# Altium schematic sheet pca20020_sheet1_cover.SchDoc: PCA20020 - Cover
size A4; DocumentNumber: 1; Revision: 1.0.0; SheetNumber: 1; SheetTotal: 9; DrawnBy: RUBR; DocumentSize: A4; PCBRevision: 0264RUBR; PCAName: PCA20020; PCBNumber: 400182
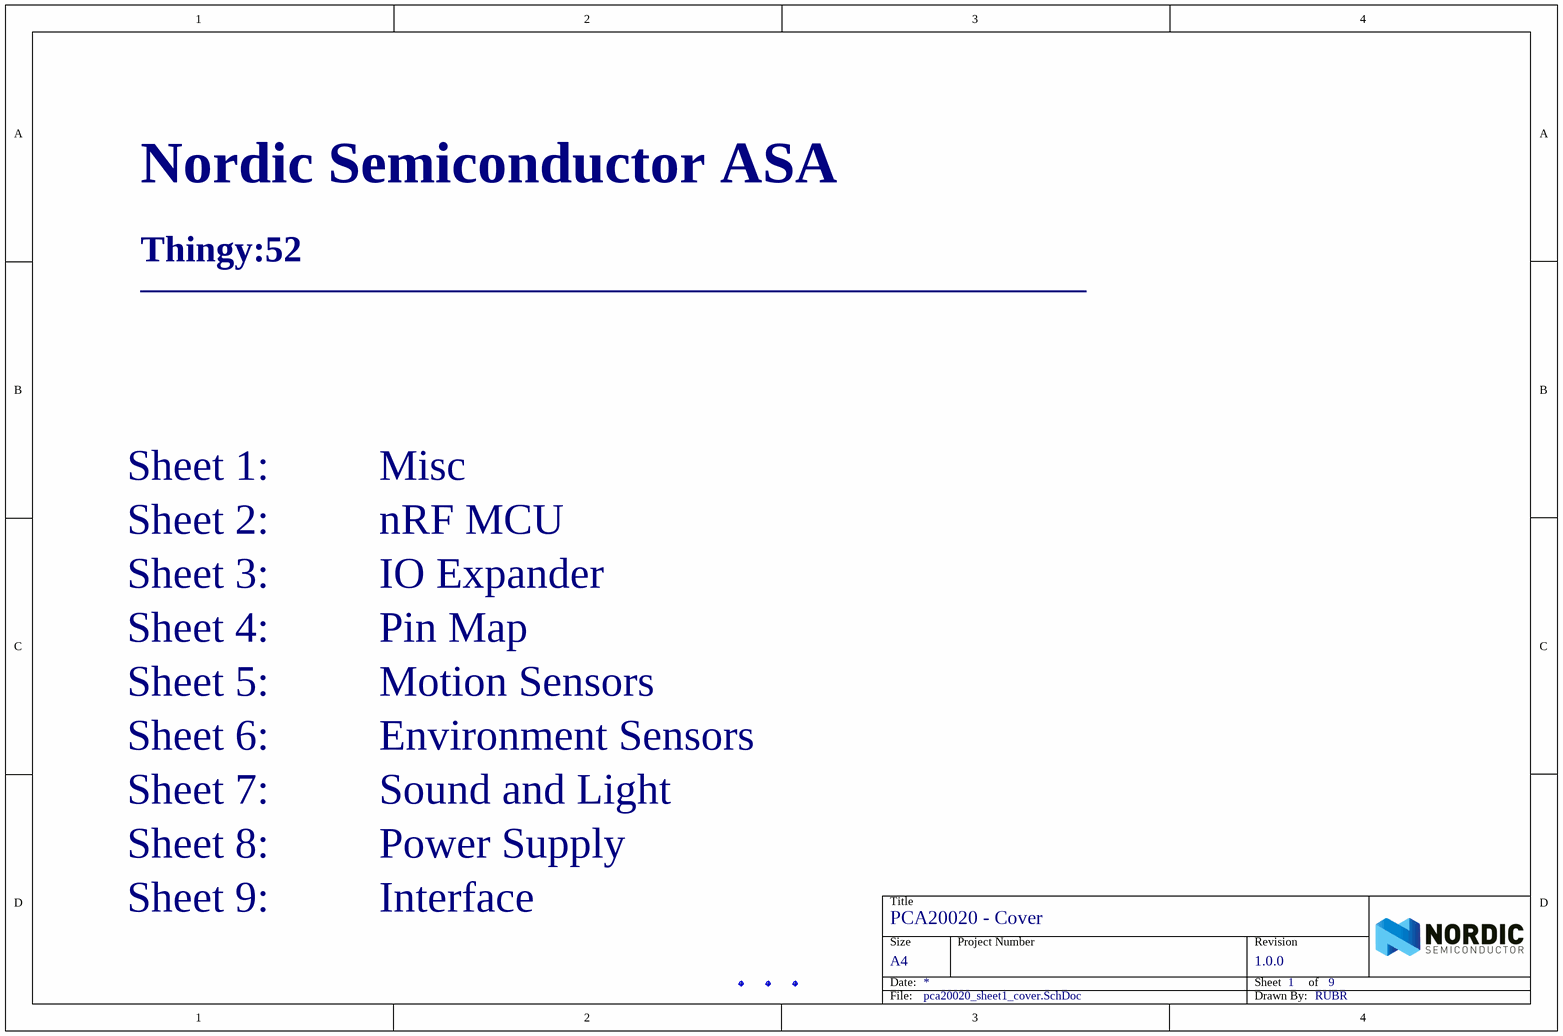
[diagram p0: pca20020_sheet1_cover.SchDoc]

## Parts
Fid1  Fiducial mark  [Fiducial_Round-Square]  (value not drawn)
Fid2  Fiducial mark  [Fiducial_Round-Square]  (value not drawn)
Fid3  Fiducial mark  [Fiducial_Round-Square]  (value not drawn)

## Notes on the sheet
- Nordic Semiconductor ASA
- Thingy:52
- ___________________________________________
- Sheet 1:          Misc
- Sheet 2:          nRF MCU
- Sheet 4:          Pin Map
- Sheet 3:          IO Expander
- Sheet 5:          Motion Sensors
- Sheet 6:          Environment Sensors
- Sheet 7:          Sound and Light
- Sheet 8:          Power Supply
- Sheet 9:          Interface
- Title
- Size
- Date:
- Project Number
- Sheet         of
- Revision
- File:
- Drawn By:

## Library data of the parts
Fid1-Fid3 = Fid-Mark-Round-Square: Artikkelnr Noca: N.A.; Part Number: Fid-Mark-Round-Square; Manufacturer: *; Manufacturer Part Number: *; Datasheet: *; LatestRevisionDate: 2017-01-30; Pin Count: 1; Publisher: Nordic Semiconductor; Published: 2009-12-12; Value: *; Note: *; Supplier: *; Supplier part number: *; 2nd source Supplier: *; 2nd source part number: *; Footprint Doc: Fiducial; Artikkelnr Simpro: N.A.